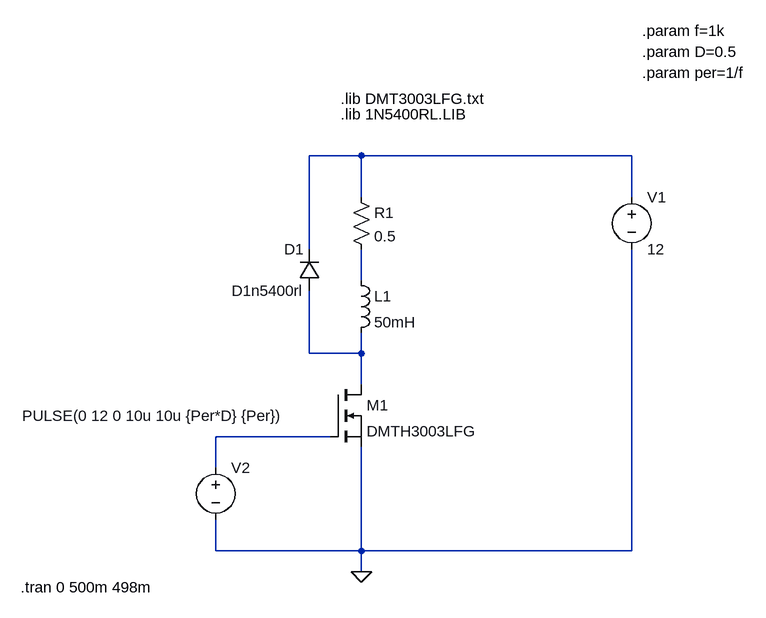
[diagram p0: schematic pmos_dmp3003lfg_switch.asc]
pmos_dmp3003lfg_switch.asc, the LTspice schematic file:
Version 4
SHEET 1 1024 680
WIRE 192 -16 112 -16
WIRE 608 -16 192 -16
WIRE 192 48 192 -16
WIRE 608 48 608 -16
WIRE 112 128 112 -16
WIRE 192 176 192 128
WIRE 112 288 112 192
WIRE 192 288 192 256
WIRE 192 288 112 288
WIRE 192 336 192 288
WIRE 144 416 -32 416
WIRE -32 464 -32 416
WIRE -32 592 -32 544
WIRE 192 592 192 432
WIRE 192 592 -32 592
WIRE 608 592 608 128
WIRE 608 592 192 592
WIRE 192 624 192 592
FLAG 192 624 0
SYMBOL nmos 144 336 R0
SYMATTR InstName M1
SYMATTR Value DMTH3003LFG
SYMATTR Prefix X
SYMBOL diode 128 192 R180
WINDOW 0 24 64 Left 2
WINDOW 3 24 0 Left 2
SYMATTR InstName D1
SYMATTR Value D1n5400rl
SYMBOL ind 176 160 R0
SYMATTR InstName L1
SYMATTR Value 50mH
SYMBOL res 176 32 R0
SYMATTR InstName R1
SYMATTR Value 0.5
SYMBOL voltage 608 32 R0
WINDOW 123 0 0 Left 0
WINDOW 39 0 0 Left 0
SYMATTR InstName V1
SYMATTR Value 12
SYMBOL voltage -32 448 R0
WINDOW 3 -298 -64 Left 2
WINDOW 123 0 0 Left 0
WINDOW 39 0 0 Left 0
SYMATTR InstName V2
SYMATTR Value PULSE(0 12 0 10u 10u {Per*D} {Per})
TEXT 160 -104 Left 2 !.lib DMT3003LFG.txt
TEXT 160 -80 Left 2 !.lib 1N5400RL.LIB
TEXT 624 -208 Left 2 !.param f=1k
TEXT 624 -176 Left 2 !.param D=0.5
TEXT 624 -144 Left 2 !.param per=1/f
TEXT -332 648 Left 2 !.tran 0 500m 498m

The netlist it stands for:
* pmos_dmp3003lfg_switch.asc
XM1 N003 N004 0 DMTH3003LFG  ; pins D G S
D1 N003 N001 D1n5400rl
L1 N002 N003 50mH
R1 N001 N002 0.5
V1 N001 0 12
V2 N004 0 PULSE(0 12 0 10u 10u {Per*D} {Per})
.model D D
.lib standard.dio
.lib DMT3003LFG.txt
.lib 1N5400RL.LIB
.param f=1k
.param D=0.5
.param per=1/f
.tran 0 500m 498m
.backanno
.end